# Altium schematic sheet Encoder.SchDoc
size A3; DocumentNumber: 8; SheetNumber: 8; SheetTotal: 9
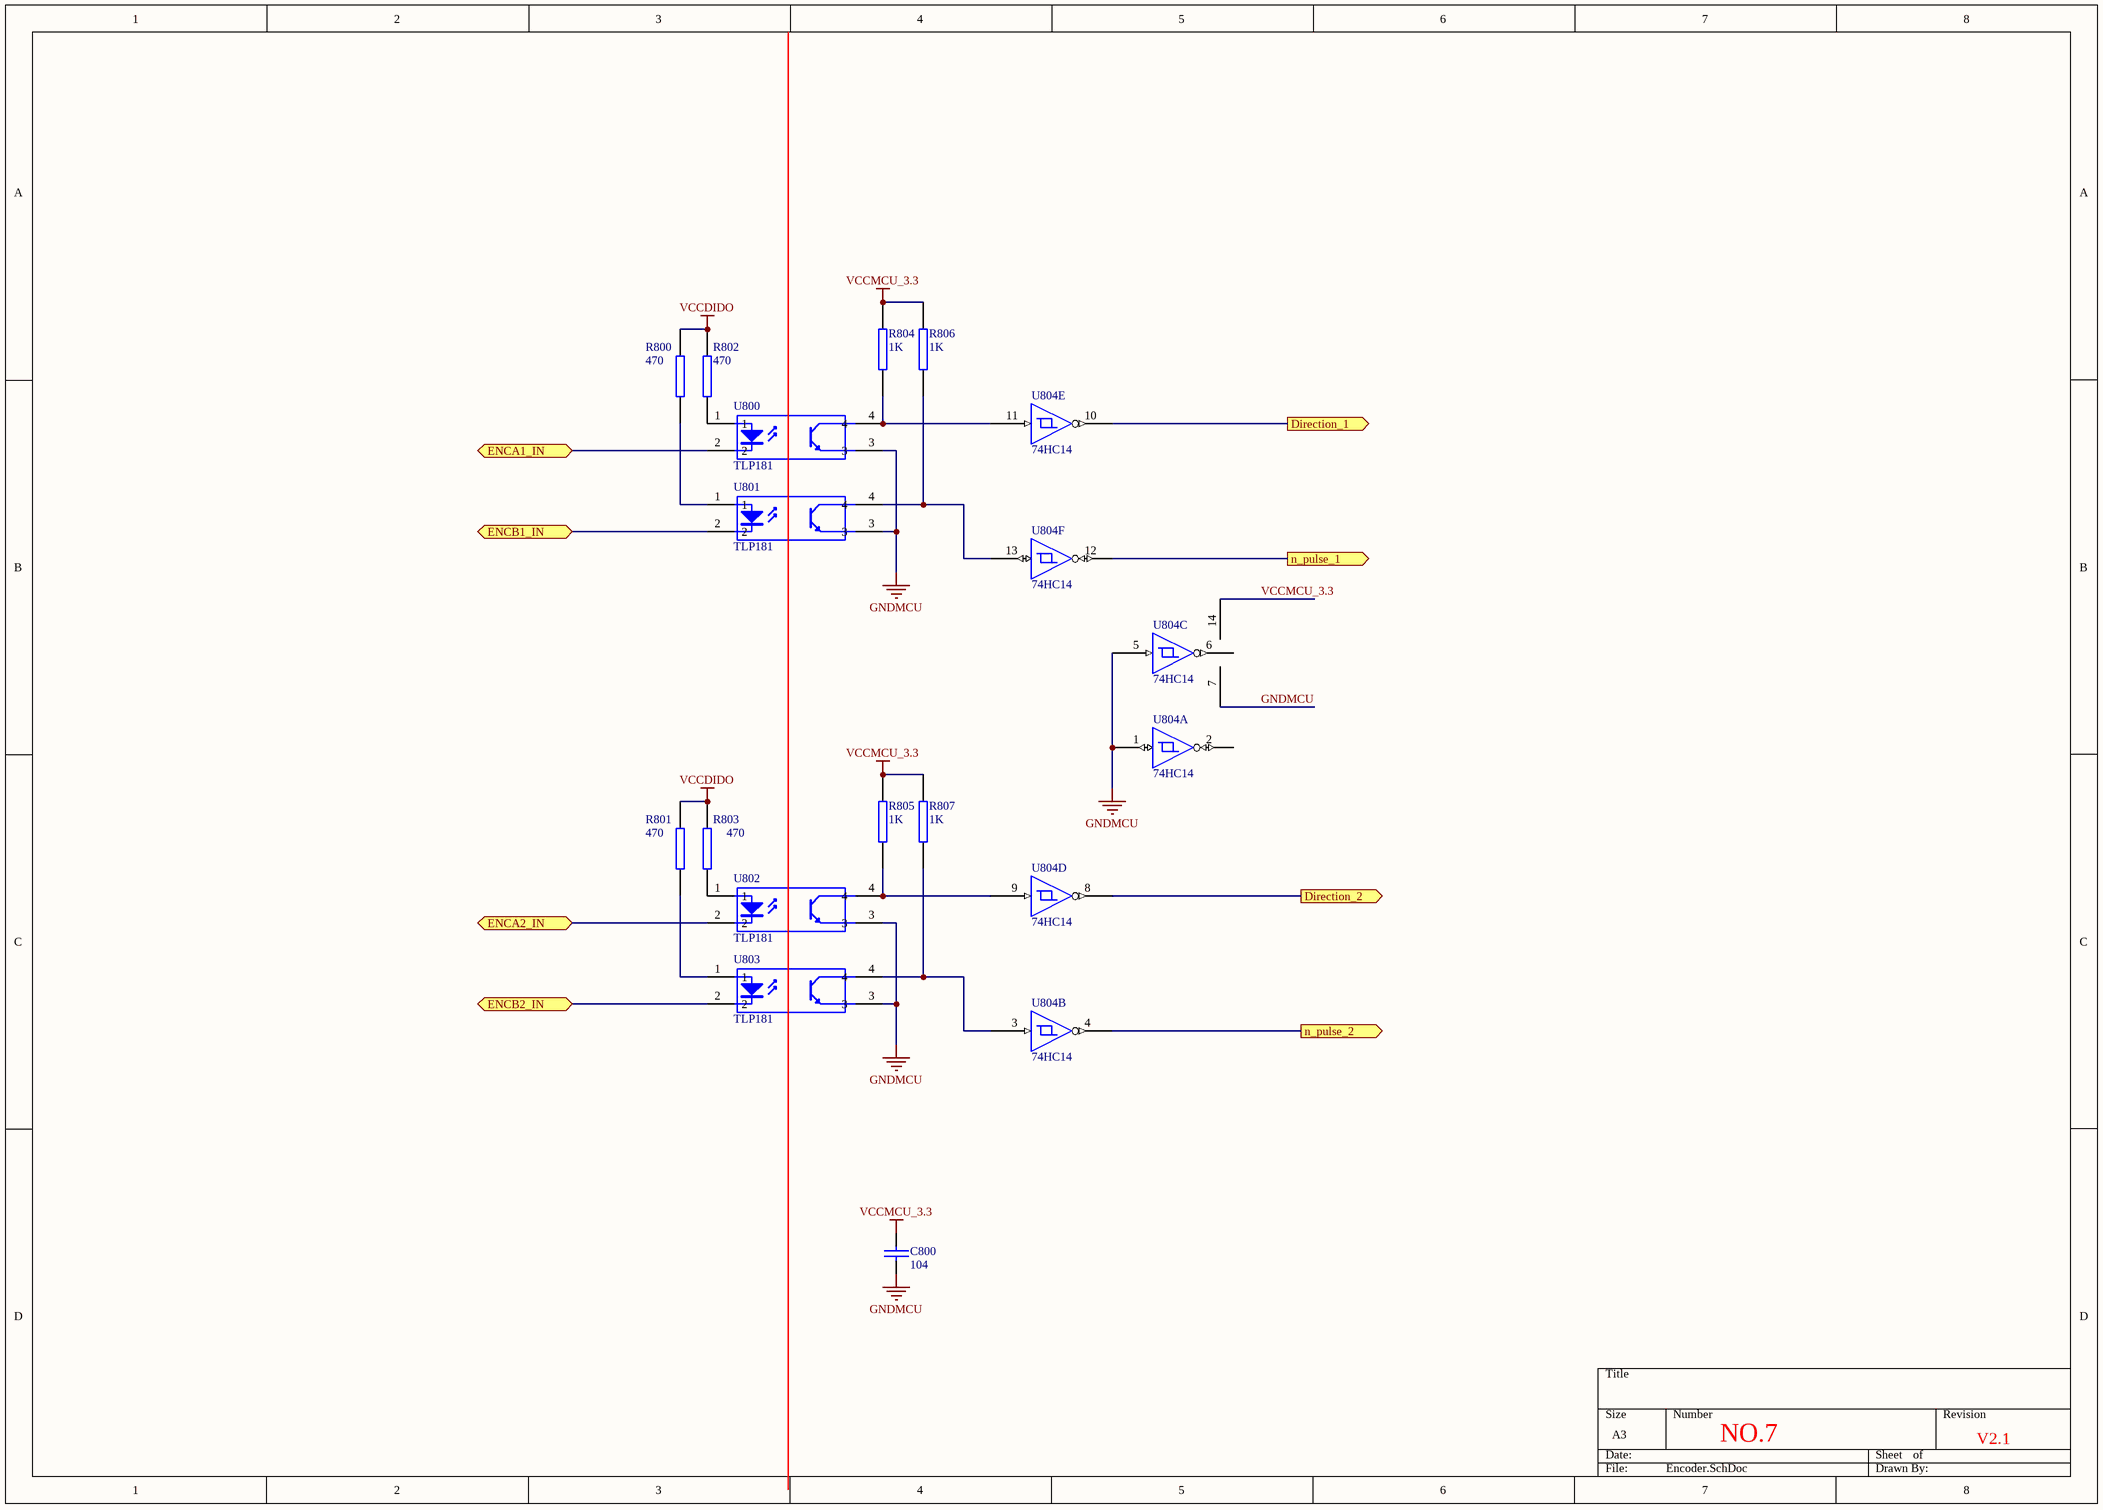
[diagram p0: Encoder.SchDoc]

## Parts
C800  104  [CAPC_E0805_2012X70N]
R800  470  [RESC_E0805_2012X50N]
R801  470  [RESC_E0805_2012X50N]
R802  470  [RESC_E0805_2012X50N]
R803  470  [RESC_E0805_2012X50N]
R804  1K  [RESC_E0805_2012X50N]
R805  1K  [RESC_E0805_2012X50N]
R806  1K  [RESC_E0805_2012X50N]
R807  1K  [RESC_E0805_2012X50N]
U800  TLP181  [TLP181]
U801  TLP181  [TLP181]
U802  TLP181  [TLP181]
U803  TLP181  [TLP181]
U804  74HC14  [SO-14]  (parts A,B,C,D,E,F of 6)

## Ports
Direction_1, Direction_2, ENCA1_IN, ENCA2_IN, ENCB1_IN, ENCB2_IN, n_pulse_1, n_pulse_2

## Nets
GNDMCU: C800.2 U800.3 U801.3 U802.3 U803.3 U804.1 U804.5 U804.7
VCCDIDO: R800.1 R801.2 R802.2 R803.1
VCCMCU_3.3: C800.1 R804.1 R805.1 R806.1 R807.1 U804.14
Direction_1: U804.10 ; port Direction_1
Direction_2: U804.8 ; port Direction_2
ENCA1_IN: U800.2 ; port ENCA1_IN
ENCA2_IN: U802.2 ; port ENCA2_IN
ENCB1_IN: U801.2 ; port ENCB1_IN
ENCB2_IN: U803.2 ; port ENCB2_IN
n_pulse_1: U804.12 ; port n_pulse_1
n_pulse_2: U804.4 ; port n_pulse_2
NetR800_2: R800.2 U801.1
NetR801_1: R801.1 U803.1
NetR802_1: R802.1 U800.1
NetR803_2: R803.2 U802.1
NetR804_2: R804.2 U800.4 U804.11
NetR805_2: R805.2 U802.4 U804.9
NetR806_2: R806.2 U801.4 U804.13
NetR807_2: R807.2 U803.4 U804.3

Not connected (* = marked no-connect by the designer): U804 2 6

## Notes on the sheet
- NO.7
- V2.1

## Library data of the parts
C800 = CAP: Capacitor
R800-R807 = RES2
U800-U803 = TLP181: 光耦隔离
U804 = 74LS14